# Altium schematic sheet Board Connector.SchDoc
size A; SheetNumber: 3; SheetTotal: 3
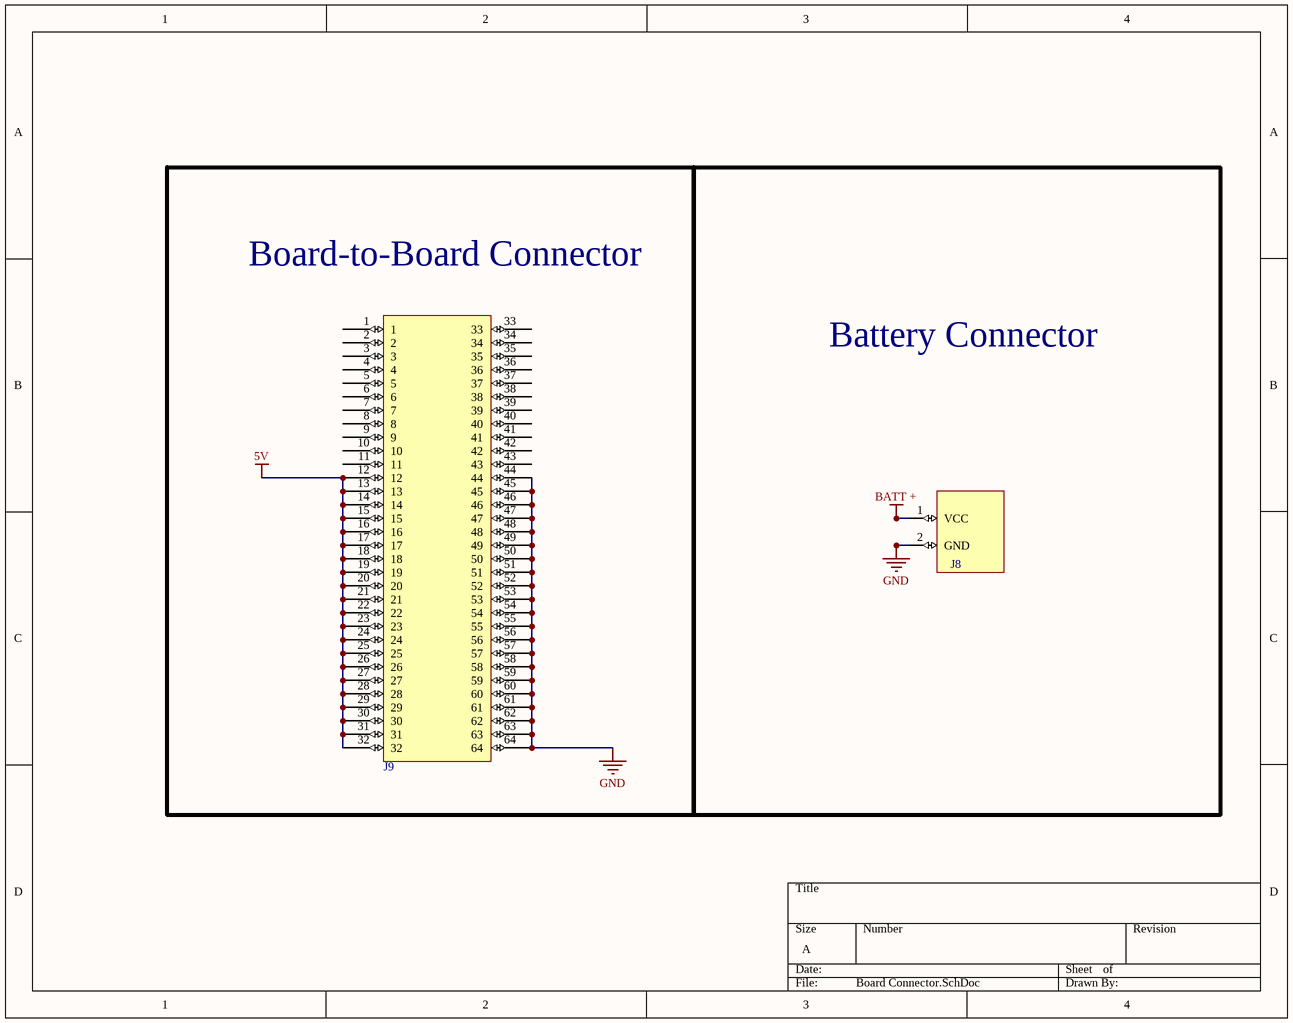
[diagram p0: Board Connector.SchDoc]

## Parts
J8  Surface Mount Pad to solder battery connector wires from power bus bar  [Battery Connector]  (value not drawn)
J9  0714392464  [1.0mm mezzanine connector 64 pin]  (value not drawn)

## Blocks framed on the sheet
Board-to-Board Connector: J9
Battery Connector: J8

## Nets
5V: J9.12 J9.13 J9.14 J9.15 J9.16 J9.17 J9.18 J9.19 J9.20 J9.21 J9.22 J9.23 J9.24 J9.25 J9.26 J9.27 J9.28 J9.29 J9.30 J9.31 J9.32
BATT +: J8.1(VCC)
GND: J8.2(GND) J9.44 J9.45 J9.46 J9.47 J9.48 J9.49 J9.50 J9.51 J9.52 J9.53 J9.54 J9.55 J9.56 J9.57 J9.58 J9.59 J9.60 J9.61 J9.62 J9.63 J9.64

Not connected (* = marked no-connect by the designer): J9 1 2 3 4 5 6 7 8 9 10 11 33 34 35 36 37 38 39 40 41 42 43

## Library data of the parts
J8 = Battery Connector: Battery connector from bus bar to board
J9 = 0714392464: 64 Position Connector Receptacle, Outer Shroud Contacts Surface Mount Gold